# EAGLE design OpenSpindle BASE (EAGLE 6.3)
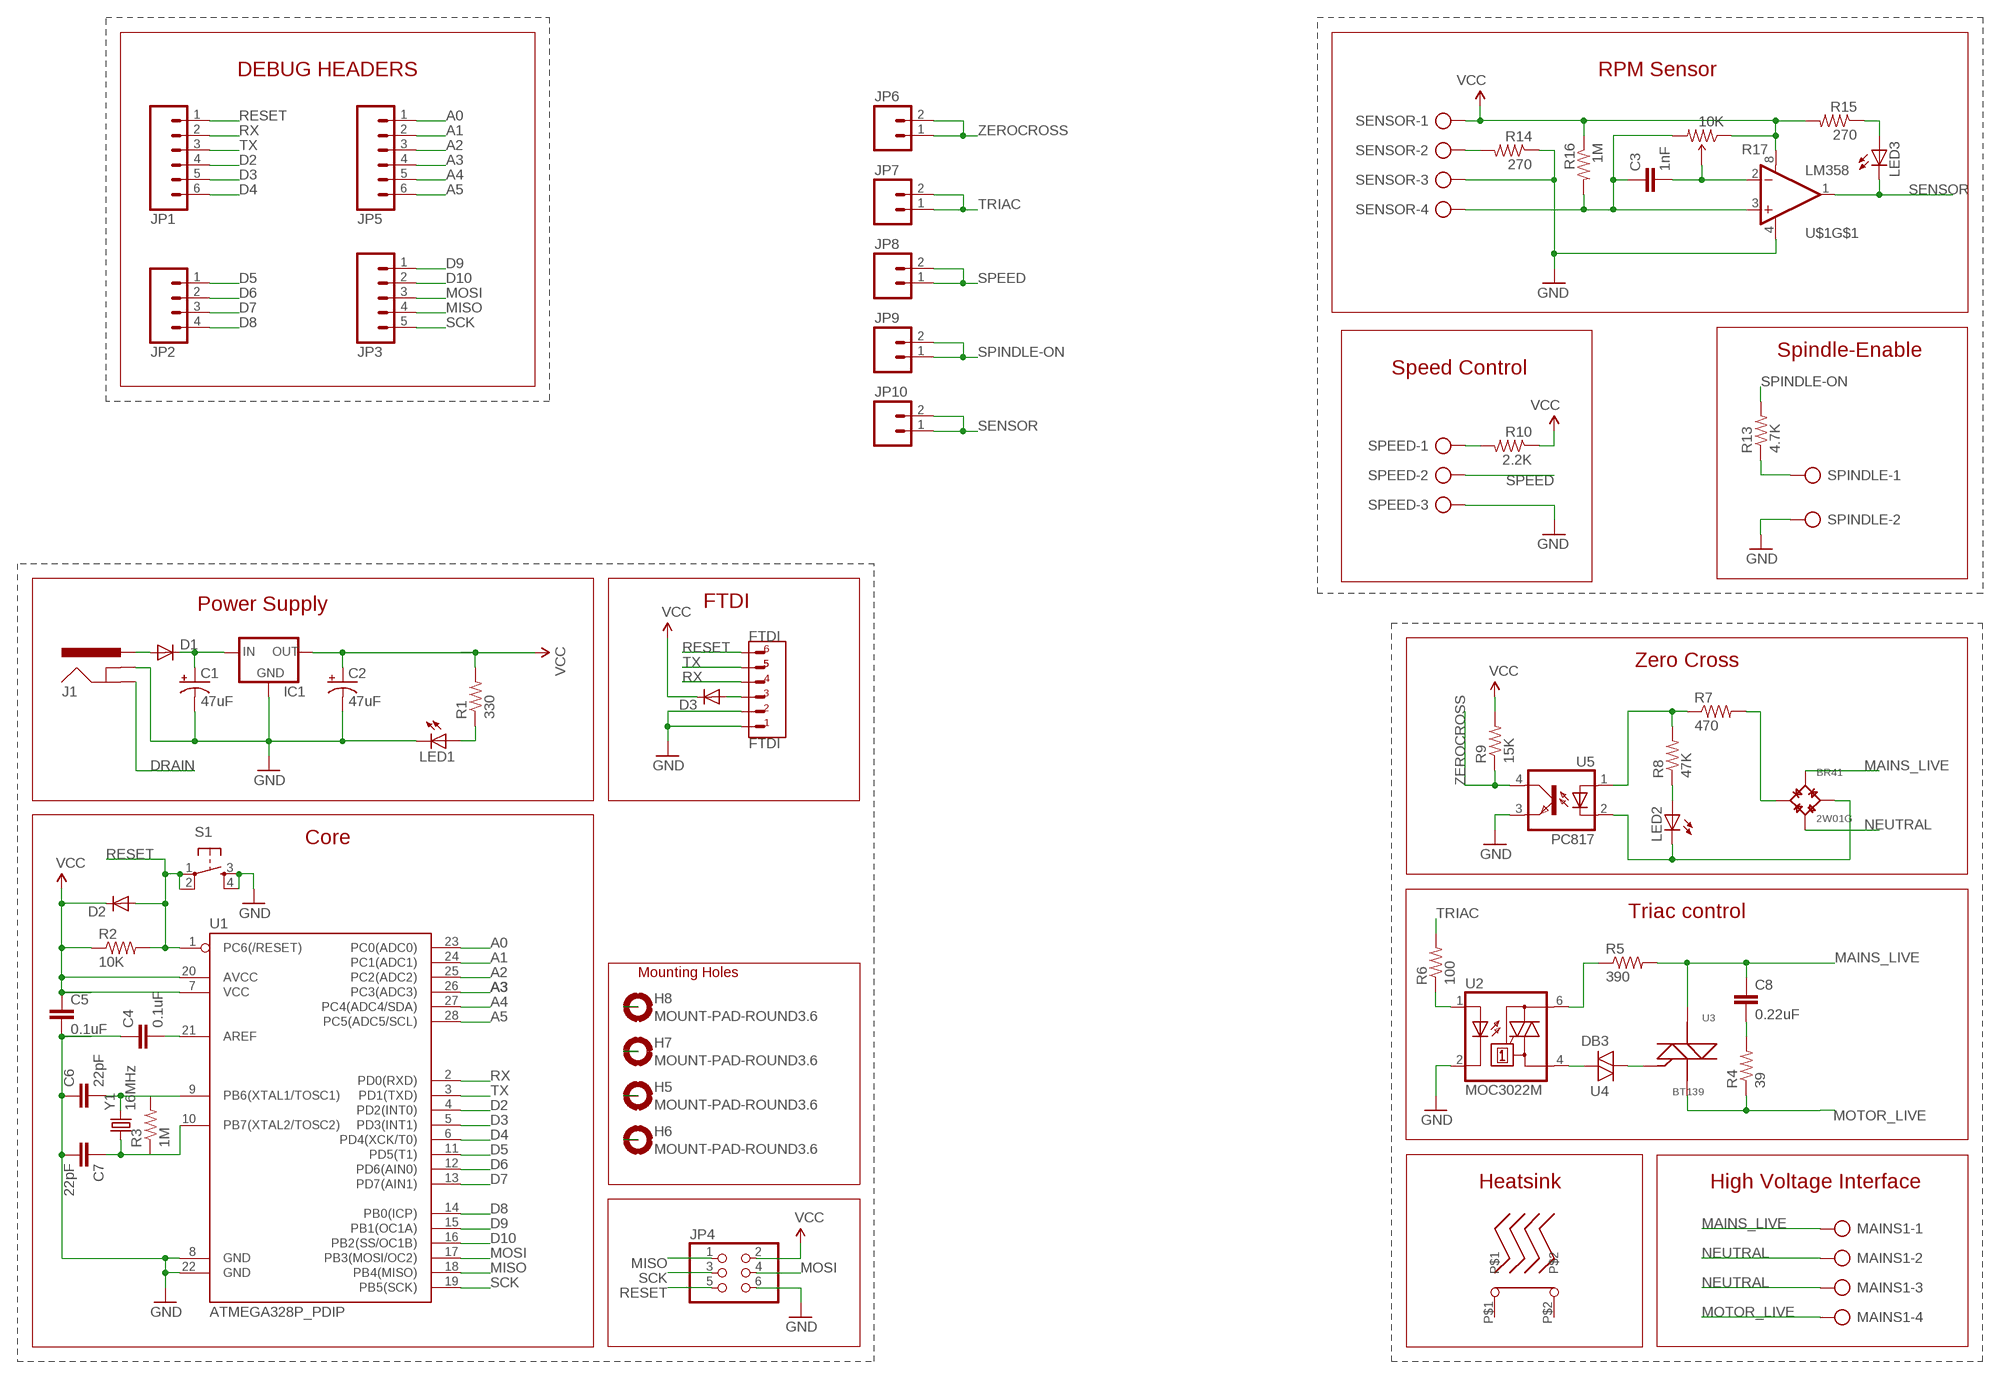
[diagram p0: schematic, sheet 1]

## Parts
BR41  2W01G  DIODEBRIDGE  [DIODEBRIDGE]
C1  47uF  CAP_POLPTH2  [CPOL-RADIAL-10UF-25V]
C2  47uF  CAP_POLPTH2  [CPOL-RADIAL-10UF-25V]
C3  1nF  CAPPTH  [CAP-PTH-SMALL]
C4  0.1uF  CAPPTH  [CAP-PTH-SMALL]
C5  0.1uF  CAPPTH  [CAP-PTH-SMALL]
C6  22pF  CAPPTH  [CAP-PTH-SMALL]
C7  22pF  CAPPTH  [CAP-PTH-SMALL]
C8  0.22uF  CAPPTH  [CAP-PTH-SMALL]
D1  DIODEPTH  [DIODE-1N4001]
D2  DIODEPTH  [DIODE-1N4001]
D3  DIODEPTH  [DIODE-1N4001]
FTDI  FTDI  6PINHEADER0.1"  [6PINHEADER]
H5  MOUNT-PAD-ROUND3.6  [3,6-PAD]
H6  MOUNT-PAD-ROUND3.6  [3,6-PAD]
H7  MOUNT-PAD-ROUND3.6  [3,6-PAD]
H8  MOUNT-PAD-ROUND3.6  [3,6-PAD]
IC1  V_REG_78XX-TO-220  [TO-220-ALT]
J1  POWER_JACKPTH_LOCK  [POWER_JACK_PTH_LOCK]
JP1  M06LOCK  [1X06_LOCK]
JP2  M04LOCK  [1X04_LOCK]
JP3  M05LOCK  [1X05_LOCK]
JP4  PINHD-2X3  [2X03]
JP5  M06LOCK  [1X06_LOCK]
JP6  M02LOCK  [1X02_LOCK]
JP7  M02LOCK  [1X02_LOCK]
JP8  M02LOCK  [1X02_LOCK]
JP9  M02LOCK  [1X02_LOCK]
JP10  M02LOCK  [1X02_LOCK]
LED1  LED5MM  [LED5MM]
LED2  LED5MM  [LED5MM]
LED3  LED5MM  [LED5MM]
MAINS1  AK500/4  [AK500/4]
R1  330  RESISTORAXIAL-0.3  [AXIAL-0.3]
R2  10K  RESISTORAXIAL-0.3  [AXIAL-0.3]
R3  1M  RESISTORAXIAL-0.3  [AXIAL-0.3]
R4  39  RESISTORAXIAL-0.3  [AXIAL-0.3]
R5  390  RESISTORAXIAL-0.3  [AXIAL-0.3]
R6  100  RESISTORAXIAL-0.3  [AXIAL-0.3]
R7  470  RESISTORM_5-10  [SQM_5-10]
R8  47K  RESISTORM_5-10  [SQM_5-10]
R9  15K  RESISTORAXIAL-0.3  [AXIAL-0.3]
R10  2.2K  RESISTORAXIAL-0.3  [AXIAL-0.3]
R13  4.7K  RESISTORAXIAL-0.3  [AXIAL-0.3]
R14  270  RESISTORAXIAL-0.3  [AXIAL-0.3]
R15  270  RESISTORAXIAL-0.3  [AXIAL-0.3]
R16  1M  RESISTORAXIAL-0.3  [AXIAL-0.3]
R17  10K  TRIMPOTTRIMPOT_PTH_S3_LOCK  [TRIMPOT_PTH_S3_LOCK]
S1  TAC_SWITCHPTH  [TACTILE-PTH]
SENSOR  AK500/4  [AK500/4]
SPEED  AK500/3  [AK500/3]
SPINDLE  AK500/2  [AK500/2]
U1  ATMEGA328P_PDIP  [DIL28-3]
U2  MOC3022M  [DIL06]
U3  BT139  TRIAC  [TRIAC]
U4  DB3  DIAC-DO35-10  [DO35-10]
U5  PC817  [DIL04]
U$1  LM358  [DIP08]
U$2  HEATSINK529802B02500G  [529802B02500G]
Y1  16MHz  CRYSTALHC49UV  [HC49U-V]

## Nets
A0: JP5.1 U1.23(PC0(ADC0))
A1: JP5.2 U1.24(PC1(ADC1))
A2: JP5.3 U1.25(PC2(ADC2))
A3: JP5.4 U1.26(PC3(ADC3))
A4: JP5.5 U1.27(PC4(ADC4/SDA))
A5: JP5.6 U1.28(PC5(ADC5/SCL))
D2: JP1.4 U1.4(PD2(INT0))
D3: JP1.5 U1.5(PD3(INT1))
D4: JP1.6 U1.6(PD4(XCK/T0))
D5: JP2.1 U1.11(PD5(T1))
D6: JP2.2 U1.12(PD6(AIN0))
D7: JP2.3 U1.13(PD7(AIN1))
D8: JP2.4 U1.14(PB0(ICP))
D9: JP3.1 U1.15(PB1(OC1A))
D10: JP3.2 U1.16(PB2(SS/OC1B))
DRAIN: J1.GND
GND: C1.2(-) C2.2(-) C4.1 C5.2 C6.1 C7.2 FTDI.P$1 FTDI.P$2 IC1.GND J1.GNDBREAK JP4.6 LED1.K(C) R14.P$1 S1.3 S1.4 SENSOR.3 SPEED.3 SPINDLE.2 U1.8(GND) U1.22(GND) U2.2(C) U5.3(EMIT) U$1.4(V-)
MAINS_LIVE: BR41.AC1 C8.1 MAINS1.1 R5.P$2 U3.2(A)
MISO: JP3.4 JP4.1 U1.18(PB4(MISO))
MOSI: JP3.3 JP4.4 U1.17(PB3(MOSI/OC2))
MOTOR_LIVE: MAINS1.4 R4.P$1 U3.3(C)
N$1: U2.4(A1) U4.C
N$2: R10.P$2 SPEED.1
N$3: U3.1(B) U4.A
N$4: LED1.A R1.P$1
N$5: C8.2 R4.P$2
N$6: R7.P1 R8.P2 U5.1(A)
N$7: BR41.- LED2.K(C) U5.2(C)
N$8: LED2.A R8.P1
N$9: H6.B3,6(MOUNT)
N$12: R13.P$1 SPINDLE.1
N$13: R6.P$1 U2.1(A)
N$14: D3.A FTDI.P$3
N$15: R5.P$1 U2.6(A2)
N$16: R14.P$2 SENSOR.2
N$17: C3.1 R16.P$2 R17.3(CW) SENSOR.4 U$1.3(+IN)
N$18: H8.B3,6(MOUNT)
N$19: H7.B3,6(MOUNT)
N$20: C7.1 R3.P$1 U1.10(PB7(XTAL2/TOSC2)) Y1.1
N$21: H5.B3,6(MOUNT)
N$22: C6.2 R3.P$2 U1.9(PB6(XTAL1/TOSC1)) Y1.2
N$24: LED3.A R15.P$1
N$25: C1.1(+) D1.C IC1.IN
N$26: D1.A J1.PWR
N$27: C3.2 R17.2(WIPER) U$1.2(-IN)
N$28: C4.2 U1.21(AREF)
N$29: BR41.+ R7.P2
NEUTRAL: BR41.AC2 MAINS1.2 MAINS1.3
RESET: D2.A FTDI.P$6 JP1.1 JP4.5 R2.P$2 S1.1 S1.2 U1.1(PC6(/RESET))
RX: FTDI.P$4 JP1.2 U1.2(PD0(RXD))
SCK: JP3.5 JP4.3 U1.19(PB5(SCK))
SENSOR: JP10.1 JP10.2 LED3.K(C) U$1.1(OUT)
SPEED: JP8.1 JP8.2 SPEED.2
SPINDLE-ON: JP9.1 JP9.2 R13.P$2
TRIAC: JP7.1 JP7.2 R6.P$2
TX: FTDI.P$5 JP1.3 U1.3(PD1(TXD))
VCC: C2.1(+) C5.1 D2.C D3.C IC1.OUT JP4.2 R1.P$2 R2.P$1 R9.P$2 R10.P$1 R15.P$2 R16.P$1 R17.1(CCW) SENSOR.1 U1.7(VCC) U1.20(AVCC) U$1.8(V+)
ZEROCROSS: JP6.1 JP6.2 R9.P$1 U5.4(COL)
Unconnected: U$1.5(+IN) U$1.6(-IN) U$1.7(OUT) U$2.P$1 U$2.P$2

## Notes on the sheet
- DEBUG HEADERS | RPM Sensor
- Spindle-Enable
- Speed Control
- Power Supply | FTDI
- Zero Cross
- Core
- Triac control
- Mounting Holes
- Heatsink | High Voltage Interface

## Library data of the parts
BR41 = connectors:DIODEBRIDGE
C1 C2 = SparkFun:CAP_POL: Capacitor Polarized These are standard SMD and PTH capacitors. Normally 10uF, 47uF, and 100uF in electrolytic and tantalum varieties. Always verify the external diameter of the through hole cap, it varies with capacity, voltage, and manufacturer. The EIA devices should be standard.
C3-C7 = SparkFun-Capacitors:CAP: Capacitor Standard 0603 ceramic capacitor, and 0.1" leaded capacitor.
C8 = SparkFun:CAP: Capacitor Standard 0603 ceramic capacitor, and 0.1" leaded capacitor.
D1-D3 = SparkFun-DiscreteSemi:DIODE: Diode These are standard reverse protection diodes and small signal diodes. SMA package can handle up to about 1A. SOD-323 can handle about 200mA. What the SOD-323 package when ordering, there are some mfgs out there that are 5-pin packages.
FTDI = connectors:6PINHEADER
H5-H8 = holes:MOUNT-PAD-ROUND: MOUNTING PAD, round
IC1 = SparkFun-PowerIC:V_REG_78XX: Voltage Regulator Standard 7805 5V regulator. IGO (Input Ground Output). Spark Fun Electronics SKU : COM-00107
J1 = SparkFun-Connectors:POWER_JACK: Power Jack This is the standard 5.5mm barrel jack for power. The PTH is the most common, proven, reliable, footprint. The Slot footprint only works if the mill layer is transmitted to the PCB fab house so be warned. Spark Fun Electronics SKU : PRT-00119 SMT: CONN-08106 Mating wall wart : TOL-00298 (and others)
JP1 JP5 = SparkFun-Connectors:M06: Header 6 Standard 6-pin 0.1" header. Use with straight break away headers (SKU : PRT-00116), right angle break away headers (PRT-00553), swiss pins (PRT-00743), machine pins (PRT-00117), and female headers (PRT-00115). Molex polarized connector foot print use with SKU : PRT-08094 with associated crimp pins and housings. NOTES ON THE VARIANTS LOCK and LOCK_LONGPADS... This footprint was designed to help hold the alignment of a through-hole component (i.e. 6-pin header) while soldering it into place. You may notice that each hole has been shifted either up or down by 0.005 of an inch from it's more standard position (which is a perfectly straight line). This slight alteration caused the pins (the squares in the middle) to touch the edges of the holes. Because they are alternating, it causes a "brace" to hold the component in place. 0.005 has proven to be the perfect amount of "off-center" position when using our standard breakaway headers. Although looks a little odd when you look at the bare footprint, once you have a header in there, the alteration is very hard to notice. Also, if you push a header all the way into place, it is covered up entirely on the bottom side. This idea of altering the position of holes to aid alignment will be further integrated into the Sparkfun Library for other footprints. It can help hold any component with 3 or more connection pins.
JP2 = SparkFun-Connectors:M04: Header 4 Standard 4-pin 0.1" header. Use with straight break away headers (SKU : PRT-00116), right angle break away headers (PRT-00553), swiss pins (PRT-00743), machine pins (PRT-00117), and female headers (PRT-00115). Molex polarized connector foot print use with SKU : PRT-08231 with associated crimp pins and housings. 1MM SMD Version SKU: PRT-10208
JP3 = SparkFun-Connectors:M05: Header 5 Standard 5-pin 0.1" header. Use with straight break away headers (SKU : PRT-00116), right angle break away headers (PRT-00553), swiss pins (PRT-00743), machine pins (PRT-00117), and female headers (PRT-00115). Molex polarized connector foot print use with SKU : PRT-08230 with associated crimp pins and housings.
JP4 = SparkFun-Connectors:PINHD-2X3: PIN HEADER
JP6-JP10 = SparkFun-Connectors:M02: Header 2 Standard 2-pin 0.1" header. Use with straight break away headers (SKU : PRT-00116), right angle break away headers (PRT-00553), swiss pins (PRT-00743), machine pins (PRT-00117), and female headers (PRT-00115). Molex polarized connector foot print use with SKU : PRT-08233 with associated crimp pins and housings.
LED1 LED3 = adafruit2012:LED: LED OSRAM: - CHIPLED LG R971, LG N971, LY N971, LG Q971, LY Q971, LO R971, LY R971 LH N974, LH R974 LS Q976, LO Q976, LY Q976 LO Q996 - Hyper CHIPLED LW Q18S LB Q993, LB Q99A, LB R99A - SideLED LS A670, LO A670, LY A670, LG A670, LP A670 LB A673, LV A673, LT A673, LW A673 LH A674 LY A675 LS A676, LA A676, LO A676, LY A676, LW A676 LS A679, LY A679, LG A679 - Hyper Micro SIDELED® LS Y876, LA Y876, LO Y876, LY Y876 LT Y87S - SmartLED LW L88C, LW L88S LB L89C, LB L89S, LG L890 LS L89K, LO L89K, LY L89K LS L896, LA L896, LO L896, LY L896 - TOPLED LS T670, LO T670, LY T670, LG T670, LP T670 LSG T670, LSP T670, LSY T670, LOP T670, LYG T670 LG T671, LOG T671, LSG T671 LB T673, LV T673, LT T673, LW T673 LH T674 LS T676, LA T676, LO T676, LY T676, LB T676, LH T676, LSB T676, LW T676 LB T67C, LV T67C, LT T67C, LS T67K, LO T67K, LY T67K, LW E67C LS E67B, LA E67B, LO E67B, LY E67B, LB E67C, LV E67C, LT E67C LW T67C LS T679, LY T679, LG T679 LS T770, LO T770, LY T770, LG T770, LP T770 LB T773, LV T773, LT T773, LW T773 LH T774 LS E675, LA E675, LY E675, LS T675 LS T776, LA T776, LO T776, LY T776, LB T776 LHGB T686 LT T68C, LB T68C - Hyper Mini TOPLED® LB M676 - Mini TOPLED Santana® LG M470 LS M47K, LO M47K, LY M47K Source: http://www.osram.convergy.de/
LED2 = SparkFun-LED:LED: LEDs Standard schematic elements and footprints for 5mm, 3mm, 1206, and 0603 sized LEDs. 5mm - Spark Fun Electronics SKU : COM-00529 (and others)
MAINS1 SENSOR = con-ptr500:AK500/4: CONNECTOR; OC_FARNELL: unknown; OC_NEWARK: unknown
R1-R10 R13-R16 = SparkFun-Resistors:RESISTOR: Resistor Basic schematic elements and footprints for 0603, 1206, and PTH resistors.
R17 = SparkFun-Electromechanical:TRIMPOT: Various small potentiometers for "set-and-forget" applications
S1 = SparkFun-Electromechanical:TAC_SWITCH: Momentary Switch Button commonly used for reset or general input. Spark Fun Electronics SKU : COM-00097 SMT- SWCH-08247
SPEED = con-ptr500:AK500/3: CONNECTOR; OC_FARNELL: unknown; OC_NEWARK: unknown
SPINDLE = con-ptr500:AK500/2: CONNECTOR; OC_FARNELL: unknown; OC_NEWARK: unknown
U1 = SparkFun-DigitalIC:ATMEGA328P_PDIP: uC used in the Arduino 32kb flash, 1k EEPROM, 2k SRAM This is the through-hole version of this chip.
U2 = optocoupler:MOC30*M: RANDOM-PHASE OPTOISOLATORS TRIAC DRIVER OUTPUT Source: http://www.fairchildsemi.com MOC3020-M.pdf; MF: FAIRCHILD SEMICONDUCTOR; MPN: MOC3022-M; OC_FARNELL: 1021086; OC_NEWARK: 58K1956
U3 = connectors:TRIAC
U4 = diode:DIAC-: DIAC
U5 = optocoupler:PC817: SHARP OPTO COUPLER; MPN: PC817X4J000F; OC_FARNELL: 9707727; OC_NEWARK: 97K7059
U$1 = SparkFun-AnalogIC:LM358: Jellybean op-amp
U$2 = OSPID:HEATSINK
Y1 = SparkFun-FreqCtrl:CRYSTAL: Various standard crystals. Proven footprints. Spark Fun Electronics SKU : COM-00534

## Net classes
1 power: width 1.016 mm, clearance 0.305 mm

## Board
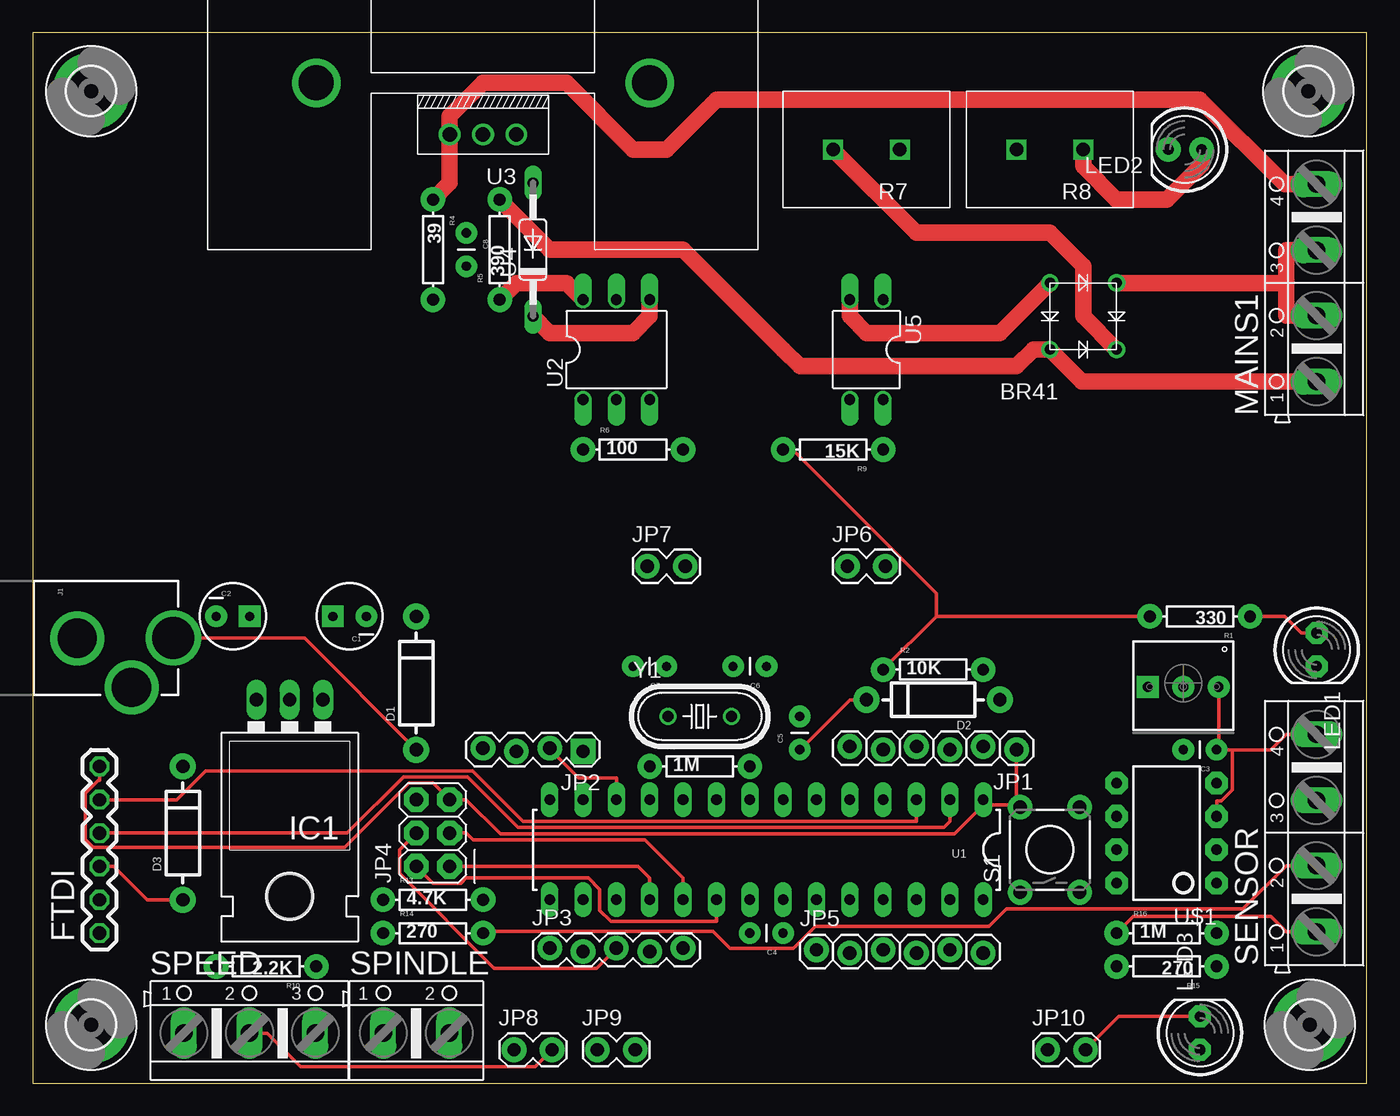
[diagram p1: board, top side]
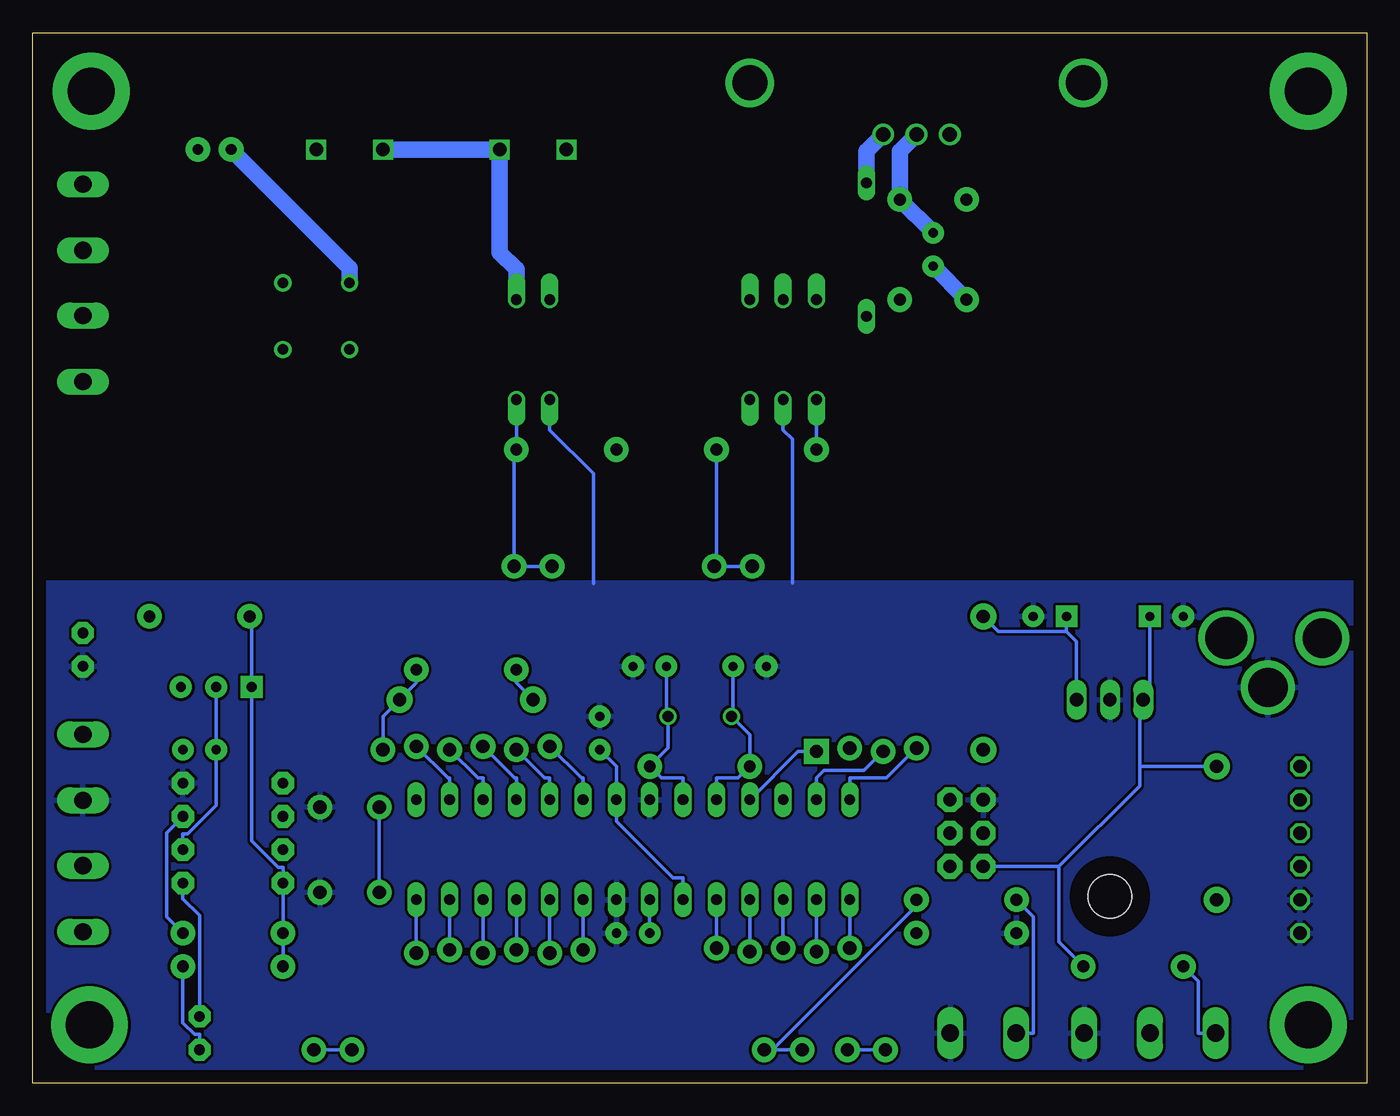
[diagram p2: board, bottom side, seen from below]

Size 101.6 x 80.01 mm. Coordinates in mm from the lower left corner, seen from the top.
Outline: 0,0 101.6,0 101.6,80.01 0,80.01 0,0
Copper layers (1*16): Top 0.035mm / dielectric 1.5mm / Bottom 0.035mm
Design rules "default": minimum track width 10mil, minimum drill 24mil, track to track 8mil, track to pad 8mil, pad to pad 8mil, via to via 8mil, smd to smd 8mil, copper to edge 40mil, drill to drill 8mil, minimum pad ring 10mil, minimum via ring 8mil, stop-mask expansion 4mil, vias tented up to drill 0mil, thermal gap 10mil

### Footprints (pad centres in the part's own frame; a part is rotated, then mirrored left to right if it is on the bottom)
DIODEBRIDGE = drill 0.8: + -2.54,2.54; - 2.54,-2.54; AC1 2.54,2.54; AC2 -2.54,-2.54
CPOL-RADIAL-10UF-25V = drill 0.7 pad 1.651 square: 1 1.27,0 | drill 0.7 pad 1.651: 2 -1.27,0
CAP-PTH-SMALL = drill 0.7 pad 1.651: 1 0,0; 2 2.54,0
DIODE-1N4001 = drill 1 pad 1.981: A -5.08,0; C 5.08,0
6PINHEADER = drill 1 octagon: P$1 -6.35,0; P$2 -3.81,0; P$3 -1.27,0; P$4 1.27,0; P$5 3.81,0; P$6 6.35,0
3,6-PAD = drill 3.6 pad 5.842: B3,6 0,0
TO-220-ALT = drill 1.016 long: GND 0,-3.81; IN -2.54,-3.81; OUT 2.54,-3.81 | hole 3.302: 0,11.176
POWER_JACK_PTH_LOCK = drill 2.997 pad 4.115: GND 0.025,6.557; GNDBREAK 3.762,10.7 | drill 3.2 pad 4.115: PWR 0,13.878
1X06_LOCK = drill 1.016 pad 1.88: 1 0,0; 2 2.54,-0.254; 3 5.08,0; 4 7.62,-0.254; 5 10.16,0; 6 12.7,-0.254
1X04_LOCK = drill 1.016 pad 1.88 square: 1 0,0.127 | drill 1.016 pad 1.88: 2 2.54,-0.127; 3 5.08,0.127; 4 7.62,-0.127
1X05_LOCK = drill 1.016 pad 1.88: 1 0,0.127; 2 2.54,-0.127; 3 5.08,0.127; 4 7.62,-0.127; 5 10.16,0.127
2X03 = drill 1.016 pad 1.88 octagon: 1 -2.54,-1.27; 2 -2.54,1.27; 3 0,-1.27; 4 0,1.27; 5 2.54,-1.27; 6 2.54,1.27
1X02_LOCK = drill 1.016 pad 1.88: 1 -0.178,0; 2 2.718,0
LED5MM = drill 0.813 pad 1.676 octagon: A -1.27,0; K 1.27,0
LED5MM' = drill 0.813 pad 1.88: A -1.27,0; K 1.27,0
AK500/4 = drill 1.321 long: 1 -7.518,0; 2 -2.489,0; 3 2.489,0; 4 7.518,0
AXIAL-0.3 = drill 0.9 pad 1.88: P$1 -3.81,0; P$2 3.81,0
SQM_5-10 = drill 1.016 square: P1 -2.54,0; P2 2.54,0
TRIMPOT_PTH_S3_LOCK = drill 0.737 pad 1.676 square: 1 -2.692,-0.305 | drill 0.737 pad 1.676: 2 0,-0.305; 3 2.692,-0.305
TACTILE-PTH = drill 1.016 pad 1.88: 1 -3.251,2.261; 2 3.251,2.261; 3 -3.251,-2.261; 4 3.251,-2.261
AK500/3 = drill 1.321 long: 1 -5.004,0; 2 0,0; 3 5.004,0
AK500/2 = drill 1.321 long: 1 -2.515,0; 2 2.515,0
DIL28-3 = drill 0.813 long: 1 -16.51,-3.81; 2 -13.97,-3.81; 3 -11.43,-3.81; 4 -8.89,-3.81; 5 -6.35,-3.81; 6 -3.81,-3.81; 7 -1.27,-3.81; 8 1.27,-3.81; 9 3.81,-3.81; 10 6.35,-3.81; 11 8.89,-3.81; 12 11.43,-3.81; 13 13.97,-3.81; 14 16.51,-3.81; 15 16.51,3.81; 16 13.97,3.81; 17 11.43,3.81; 18 8.89,3.81; 19 6.35,3.81; 20 3.81,3.81; 21 1.27,3.81; 22 -1.27,3.81; 23 -3.81,3.81; 24 -6.35,3.81; 25 -8.89,3.81; 26 -11.43,3.81; 27 -13.97,3.81; 28 -16.51,3.81
DIL06 = drill 0.813 offset: 1 -2.54,-3.81; 2 0,-3.81; 3 2.54,-3.81; 4 2.54,3.81; 5 0,3.81; 6 -2.54,3.81
TRIAC = drill 1.1: 1 -2.54,0; 2 0,0; 3 2.54,0
DO35-10 = drill 0.813 long: A 5.08,0; C -5.08,0
DIL04 = drill 0.813 offset: 1 -1.27,-3.81; 2 1.27,-3.81; 3 1.27,3.81; 4 -1.27,3.81
DIP08 = drill 0.813 pad 1.727 octagon: 1 -3.81,-3.81; 2 -1.27,-3.81; 3 1.27,-3.81; 4 3.81,-3.81; 5 3.81,3.81; 6 1.27,3.81; 7 -1.27,3.81; 8 -3.81,3.81
529802B02500G = drill 2.667: P$1 12.7,0; P$2 -12.7,0
HC49U-V = drill 0.813: 1 -2.413,0; 2 2.413,0

### Placement (x,y rotation side)
BR41  80.01,58.42 180 top
C1  24.13,35.56 180 top
C2  15.24,35.56 0 top
C3  90.17,25.4 180 top
C4  57.15,11.43 180 top
C5  58.42,25.4 90 top
C6  55.88,31.75 180 top
C7  48.26,31.75 180 top
C8  33.02,64.77 270 top
D1  29.21,30.48 90 top
D2  68.58,29.21 180 top
D3  11.43,19.05 90 top
FTDI  5.08,17.78 90 top
H5  4.45,4.45 0 top
H6  4.45,75.56 0 top
H7  97.16,75.56 0 top
H8  97.28,4.45 0 top
IC1  19.56,25.4 180 top
J1  -3.17,33.91 270 top
JP1  74.93,25.4 180 top
JP2  41.91,25.4 180 top
JP3  39.37,10.16 0 top
JP4  30.48,19.05 90 top
JP5  59.69,10.16 0 top
JP6  62.23,39.37 0 top
JP7  46.99,39.37 0 top
JP8  36.83,2.54 0 top
JP9  43.18,2.54 0 top
JP10  77.47,2.54 0 top
LED1  97.79,33.02 270 top
LED2  [LED5MM']  87.76,71.12 180 top
LED3  88.9,3.81 90 top
MAINS1  97.79,60.96 90 top
R1  88.9,35.56 180 top
R2  68.58,31.5 0 top
R3  50.8,24.13 0 top
R4  30.48,63.5 270 top
R5  35.56,63.5 90 top
R6  45.72,48.26 0 top
R7  63.5,71.12 180 top
R8  77.47,71.12 180 top
R9  60.96,48.26 180 top
R10  17.78,8.89 180 top
R13  30.48,13.97 0 top
R14  30.48,11.43 0 top
R15  86.36,8.89 180 top
R16  86.36,11.43 0 top
R17  87.63,30.48 0 top
S1  77.47,17.78 90 top
SENSOR  97.79,19.05 90 top
SPEED  16.51,3.81 0 top
SPINDLE  29.21,3.81 0 top
U1  55.88,17.78 180 top
U2  44.45,55.88 0 top
U3  34.29,72.26 180 top
U4  38.1,63.5 90 top
U5  63.5,55.88 180 top
U$1  86.36,19.05 90 top
U$2  34.29,76.2 0 top
Y1  50.8,27.94 0 top

### Tracks (layer width: path | path; a pad name or v marks a point on that pad's centre or on a via)
A0
  Bottom 0.254: U1.23 JP5.1
A1
  Bottom 0.254: U1.24 JP5.2
A2
  Bottom 0.254: U1.25 JP5.3
A3
  Bottom 0.254: U1.26 JP5.4
A4
  Bottom 0.254: U1.27 JP5.5
A5
  Bottom 0.254: U1.28 JP5.6
D2
  Bottom 0.254: U1.4 64.77,23.24 64.9,23.24 JP1.4
D3
  Bottom 0.254: U1.5 62.23,23.24 62.61,23.24 JP1.5
D4
  Bottom 0.254: U1.6 59.69,23.24 59.82,23.24 JP1.6
D5
  Bottom 0.254: U1.11 43.31,25.27 JP2.1
D6
  Top 0.254: U1.12 44.45,23.24 41.58,23.24 39.37,25.45 JP2.2
D7
  Bottom 0.254: U1.13 41.91,23.24 41.34,23.82 38.29,23.82 JP2.3
D8
  Bottom 0.254: U1.14 39.37,23.24 36.58,23.24 JP2.4
D9
  Bottom 0.254: U1.15 JP3.1
D10
  Bottom 0.254: U1.16 JP3.2
GND
  Bottom 0.254: U5.3 62.23,49.76 58.9,46.43 58.9,38.07 | U2.2 44.45,49.76 43.74,49.05 43.74,38.1
  pour Bottom: 101.35,0.25 101.35,38.1 0.38,38.1 0.38,0.38
MAINS_LIVE
  Top 1.27: MAINS1.1 79.91,53.44 BR41.AC1 76.2,55.88 74.93,54.61 58.42,54.61 57.15,55.88 49.53,63.5 39.37,63.5 R5.P$2
  Bottom 1.27: C8.1 R5.P$2 35.56,70.99 U3.2
MISO
  Top 0.254: U1.18 46.99,15.62 46.1,16.51 JP4.1
  Bottom 0.254: U1.18 JP3.4
MOSI
  Top 0.254: JP3.3 42.92,8.76 35.14,8.76 27.94,15.97 27.94,17.78 JP4.4
  Bottom 0.254: U1.17 JP3.3
MOTOR_LIVE
  Top 1.27: MAINS1.4 95.35,68.48 88.9,74.93 52.07,74.93 48.26,71.12 45.72,71.12 40.64,76.2 34.29,76.2 31.75,73.66 U3.3 31.75,69.85 31.75,68.58 R4.P$1
N$1
  Top 1.27: U4.C 39.37,57.15 45.72,57.15 46.99,58.42 U2.4
N$2
  Bottom 0.254: SPEED.1 12.83,3.81 12.83,7.75 R10.P$2
N$3
  Bottom 1.27: U4.A 38.1,70.99 U3.1
N$4
  Top 0.254: LED1.A 96.62,34.29 95.35,35.56 R1.P$1
N$5
  Bottom 1.27: R4.P$2 C8.2
N$6
  Bottom 1.27: R8.P2 73.84,71.12 R7.P1 66.04,63.27 64.77,62 U5.1
N$7
  Top 1.27: BR41.- 73.66,57.15 63.5,57.15 62.23,58.42 U5.2
  Bottom 1.27: LED2.K 77.47,62.1 BR41.-
N$8
  Top 1.27: LED2.A 89.03,69.98 86.36,67.31 82.55,67.31 80.01,69.85 R8.P1
N$12
  Bottom 0.254: SPINDLE.1 25.38,3.81 25.38,12.68 R13.P$1
N$13
  Bottom 0.254: U2.1 R6.P$1
N$14
  Top 0.254: FTDI.P$3 6.16,16.51 8.7,13.97 D3.A
N$15
  Top 1.27: R5.P$1 36.83,60.96 40.64,60.96 U2.6
N$16
  Top 0.254: SENSOR.2 95.48,16.56 92.18,13.26 74.16,13.26 72.84,11.94 59.61,11.94 57.94,10.27 53.11,10.27 51.82,11.56 34.42,11.56 R14.P$2
N$17
  Top 0.254: 90.32,25.4 91.36,25.4 | C3.1 90.32,25.4 | 90.32,25.4 R17.3 | U$1.3 90.17,21.51 90.54,21.51 91.36,22.34 91.36,25.4 | 91.36,25.4 94.31,25.4 95.48,26.57 SENSOR.4
  Bottom 0.254: R16.P$2 91.41,12.67 91.41,19.08 U$1.3
N$20
  Bottom 0.254: C7.1 48.26,28.07 Y1.1 46.99,26.54 R3.P$1 47.88,23.24 49.53,23.24 U1.10
N$22
  Bottom 0.254: U1.9 52.07,23.24 53.72,23.24 R3.P$2 53.21,25.53 Y1.2 53.34,28.07 C6.2
N$24
  Bottom 0.254: LED3.A 88.9,3.71 89.26,3.71 90.17,4.62 R15.P$1
N$25
  Bottom 0.254: 22.86,34.4 28.05,34.4 D1.C | 22.86,34.4 22.86,34.52 C1.1 | IC1.IN 22.1,33.64 22.86,34.4
N$26
  Top 0.254: J1.PWR 20.7,33.91 D1.A
N$27
  Bottom 0.254: R17.2 C3.2 87.63,21.14 89.8,18.97 90.17,18.97 U$1.2
N$28
  Bottom 0.254: U1.21 C4.2
N$29
  Top 1.27: R7.P2 67.31,64.77 77.47,64.77 80.01,62.23 80.01,58.42 BR41.+
NEUTRAL
  Top 1.27: 95.48,60.96 BR41.AC2 | 95.48,60.96 95.48,58.47 MAINS1.2 | 95.48,60.96 95.48,63.45 MAINS1.3
RESET
  Top 0.254: 72.39,21.18 70.19,18.98 35.63,18.98 33.02,21.59 JP4.5 30.48,22.86 28.64,22.86 23.74,17.96 4.59,17.96 3.98,18.56 3.98,22.06 4.97,23.05 5.08,23.05 FTDI.P$6 | 72.39,21.18 74.93,21.18 | 74.93,21.18 75.06,21.18 S1.2 | 74.93,21.18 JP1.1 | U1.1 72.39,21.18
  Bottom 0.254: R2.P$2 72.39,30.48 D2.A 74.93,27.94 JP1.1 | S1.1 S1.2
RX
  Top 0.254: FTDI.P$4 23.95,19.05 28.23,23.32 33.12,23.32 36.95,19.48 69.39,19.48 69.85,19.94 U1.2
  Bottom 0.254: U1.2 69.85,23.24 69.98,23.24 JP1.2
SCK
  Top 0.254: JP4.3 33.02,19.05 33.55,18.52 46.63,18.52 49.53,15.62 U1.19
  Bottom 0.254: U1.19 JP3.5
SENSOR
  Top 0.254: LED3.K 82.73,5.08 JP10.2
  Bottom 0.254: LED3.K 88.9,6.25 | U$1.1 90.17,14.05 88.9,12.78 88.9,6.25 | 88.9,6.25 | JP10.1 JP10.2
SPEED
  Top 0.254: SPEED.2 17.83,3.81 20.39,1.25 38.26,1.25 JP8.2
  Bottom 0.254: JP8.1 JP8.2
SPINDLE-ON
  Bottom 0.254: R13.P$2 34.29,13.51 45.26,2.54 | 45.26,2.54 JP9.2 | 45.26,2.54 JP9.1
TRIAC
  Bottom 0.254: R6.P$2 49.53,39.55 JP7.2 JP7.1
TX
  Top 0.254: FTDI.P$5 10.97,21.59 13.16,23.78 33.5,23.78 37.34,19.94 67.31,19.94 U1.3
  Bottom 0.254: U1.3 67.31,23.24 67.69,23.24 JP1.3
VCC
  Top 0.254: 68.83,35.56 R2.P$1 | R1.P$2 68.83,35.56 | 68.83,35.56 68.83,37.3 57.88,48.26 R9.P$2 | SENSOR.1 95.48,11.53 94.3,12.71 83.83,12.71 R16.P$1 | C5.1 62.23,29.21 D2.C | U1.20 52.07,12.32 44.03,12.32 43.18,13.17 43.18,14.78 42.34,15.62 33.02,15.62 32.64,15.24 30.48,15.24 JP4.2
  Bottom 0.254: 17.3,24.13 17.3,29.21 | 23.45,16.51 17.3,22.66 17.3,24.13 | 17.3,24.13 D3.C | 23.45,16.51 JP4.2 | R10.P$1 23.45,10.75 23.45,16.51 | 17.3,29.21 16.51,30 C2.1 | IC1.OUT 17.3,29.21 | R1.P$2 84.94,35.41 R17.1 84.94,18.45 82.92,16.43 82.55,16.43 U$1.8 R16.P$1 R15.P$2 | D2.C 64.77,30.48 R2.P$1 | U1.20 52.07,15.62 52.83,15.62 57.15,19.94 U1.7 57.15,24.13 C5.1
ZEROCROSS
  Bottom 0.254: U5.4 R9.P$1 64.95,48.08 JP6.2 JP6.1